# Altium schematic sheet Apollo_2.SchDoc
size A4
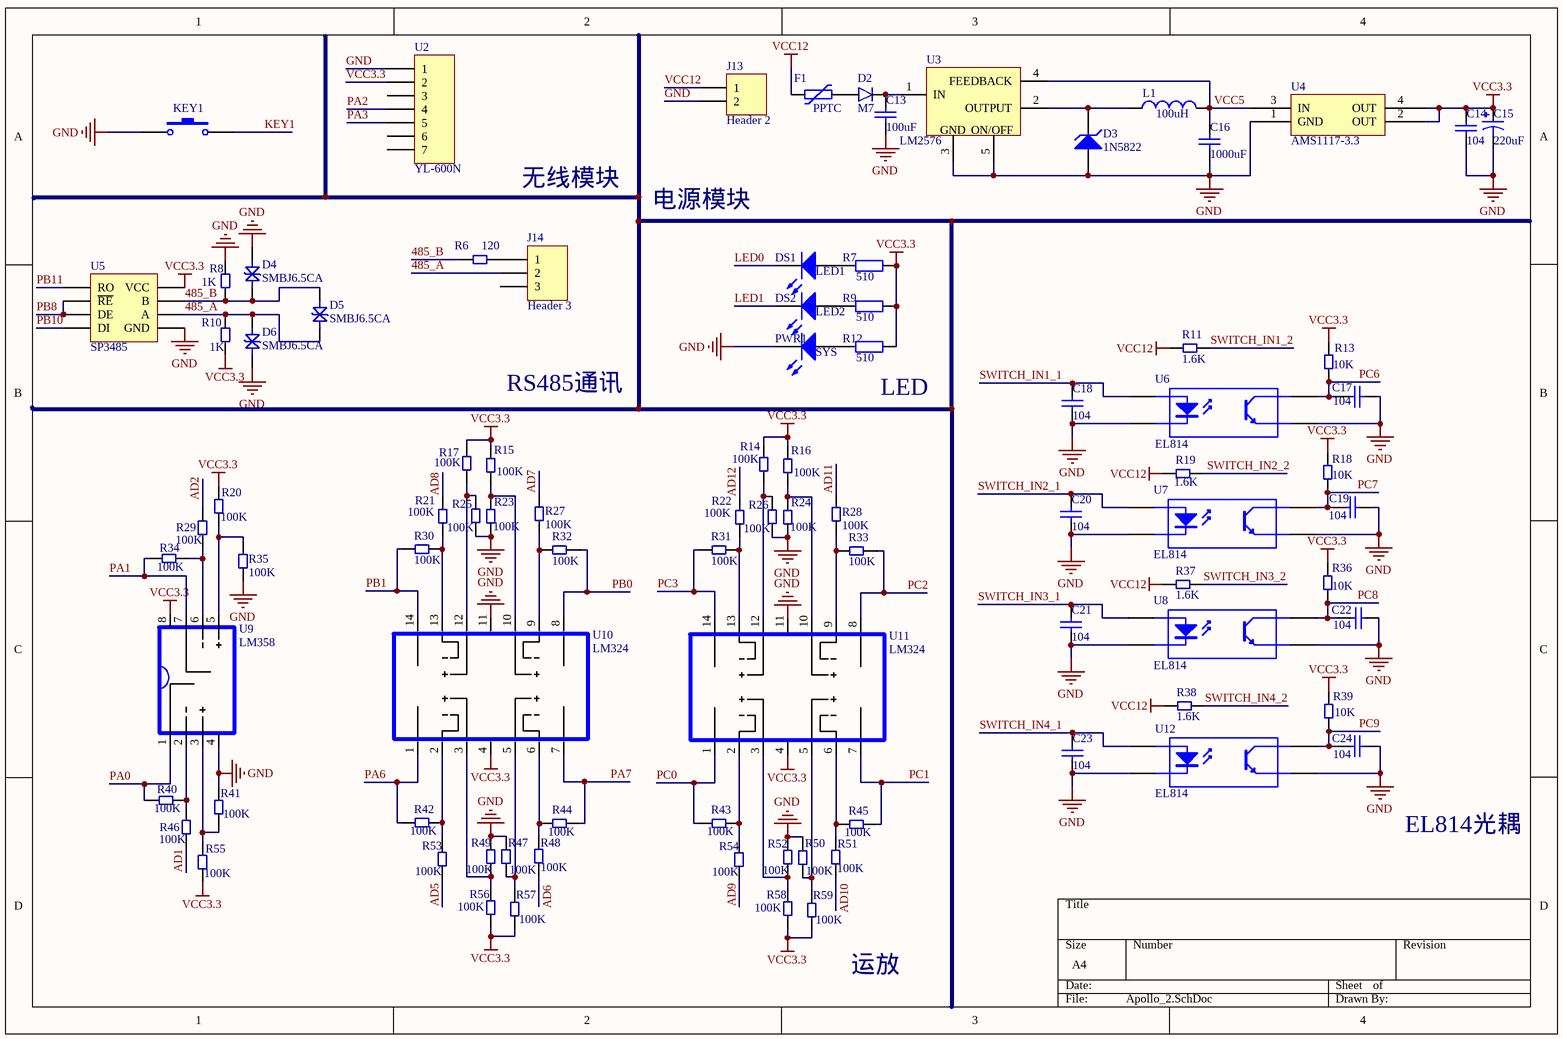
[diagram p0: Apollo_2.SchDoc]

## Parts
C13  value 100uF  [cap3.3-8 - duplicate]
C14  value 104  [0805]  (hidden comment: Cap)
C15  value 220uF  [C15]  (hidden comment: Cap Pol1)
C16  value 1000uF  [C16]
C17  value 104  [0805C]
C18  value 104  [0805C]
C19  value 104  [0805C]
C20  value 104  [0805C]
C21  value 104  [0805C]
C22  value 104  [0805C]
C23  value 104  [0805C]
C24  value 104  [0805C]
D2  M7  [SMA (DO-214AC)]
D3  1N5822  [smb do214aa]
D4  SMBJ6.5CA  [smb do214aa]
D5  SMBJ6.5CA  [smb do214aa]
D6  SMBJ6.5CA  [smb do214aa]
DS1  LED1  [0805-D]
DS2  LED2  [0805-D]
F1  PPTC  [1206]
J13  Header 2  [2EDG 2-3.80]
J14  Header 3  [HDR1X3]
KEY1  SW-PB  [SWITCH]  (value not drawn)
L1  value 100uH  [l1212]
PWR1  SYS  [0805-D]
R6  120  [0805]
R7  value 510  [0805]
R8  1K  [0805]
R9  value 510  [0805]
R10  1K  [0805]
R11  1.6K  [0805]
R12  value 510  [0805]
R13  10K  [0805]
R14  100K  [0805]
R15  100K  [0805]
R16  100K  [0805]
R17  100K  [0805]
R18  10K  [0805]
R19  1.6K  [0805]
R20  100K  [0805]
R21  100K  [0805]
R22  100K  [0805]
R23  100K  [0805]
R24  100K  [0805]
R25  100K  [0805]
R26  100K  [0805]
R27  100K  [0805]
R28  100K  [0805]
R29  100K  [0805]
R30  100K  [0805]
R31  100K  [0805]
R32  100K  [0805]
R33  100K  [0805]
R34  100K  [0805]
R35  100K  [0805]
R36  10K  [0805]
R37  1.6K  [0805]
R38  1.6K  [0805]
R39  10K  [0805]
R40  100K  [0805]
R41  100K  [0805]
R42  100K  [0805]
R43  100K  [0805]
R44  100K  [0805]
R45  100K  [0805]
R46  100K  [0805]
R47  100K  [0805]
R48  100K  [0805]
R49  100K  [0805]
R50  100K  [0805]
R51  100K  [0805]
R52  100K  [0805]
R53  100K  [0805]
R54  100K  [0805]
R55  100K  [0805]
R56  100K  [0805]
R57  100K  [0805]
R58  100K  [0805]
R59  100K  [0805]
U2  YL-600N  [HDR1X7]
U3  LM2576  [TO-263-5]
U4  AMS1117-3.3  [AMS1117-3.3]
U5  SP3485  [sop8]
U6  EL814  [SOP4]
U7  EL814  [SOP4]
U8  EL814  [SOP4]
U9  LM358  [sop8]
U10  LM324  [SOP-14]
U11  LM324  [SOP-14]
U12  EL814  [SOP4]

## Nets
GND: C13.1 C14.1 C15.2 C16.1 C17.1 C18.1 C19.1 C20.1 C21.1 C22.1 C23.1 C24.1 D3.1(A) D4.1 D6.2 J13.2 KEY1.1 PWR1.2(K) R8.2 R23.2 R24.2 R25.2 R26.2 R35.2 R41.2 R47.2 R49.2 R50.2 R52.2 U2.1 U3.3 U3.5 U4.1(GND) U5.5(GND) U6.2(K) U6.3(E) U7.2(K) U7.3(E) U8.2(K) U8.3(E) U9.4 U10.11 U11.11 U12.2(K) U12.3(E)
VCC3.3: C14.2 C15.1 R7.2 R9.2 R10.1 R12.2 R13.1 R14.1 R15.1 R16.1 R17.1 R18.1 R20.2 R36.1 R39.1 R55.1 R56.1 R57.1 R58.1 R59.1 U2.2 U4.2(OUT) U4.4(OUT) U5.8(VCC) U9.8 U10.4 U11.4
VCC12: F1.1 J13.1 R11.1 R19.1 R37.1 R38.1
485_A: D5.2 D6.1 J14.2 R10.2 U5.6(A)
485_B: D4.2 D5.1 R6.2 R8.1 U5.7(B)
AD1: R46.1
AD2: R29.2
AD5: R53.1
AD6: R48.1
AD7: R27.1
AD8: R21.1
AD9: R54.1
AD10: R51.1
AD11: R28.1
AD12: R22.1
KEY1: KEY1.2
LED0: DS1.2(K)
LED1: DS2.2(K)
PA0: R40.2 U9.1
PA1: R34.2 U9.7
PA2: U2.4
PA3: U2.5
PA6: R42.2 U10.1
PA7: R44.1 U10.7
PB0: R32.2 U10.8
PB1: R30.1 U10.14
PB8: U5.2(~{RE}) U5.3(DE)
PB10: U5.4(DI)
PB11: U5.1(RO)
PC0: R43.2 U11.1
PC1: R45.1 U11.7
PC2: R33.2 U11.8
PC3: R31.1 U11.14
PC6: C17.2 R13.2 U6.4(C)
PC7: C19.2 R18.2 U7.4(C)
PC8: C22.2 R36.2 U8.4(C)
PC9: C24.2 R39.2 U12.4(C)
SWITCH_IN1_1: C18.2 U6.1(A)
SWITCH_IN1_2: R11.2
SWITCH_IN2_1: C20.2 U7.1(A)
SWITCH_IN2_2: R19.2
SWITCH_IN3_1: C21.2 U8.1(A)
SWITCH_IN3_2: R37.2
SWITCH_IN4_1: C23.2 U12.1(A)
SWITCH_IN4_2: R38.2
VCC5: C16.2 L1.2 U3.4(FEEDBACK) U4.3(IN)
NetC13_2: C13.2 D2.1(-) U3.1(IN)
NetD2_2: D2.2(+) F1.2
NetD3_2: D3.2(K) L1.1 U3.2(OUTPUT)
NetDS1_1: DS1.1(A) R7.1
NetDS2_1: DS2.1(A) R9.1
NetJ14_1: J14.1 R6.1
NetPWR1_1: PWR1.1(A) R12.1
NetR14_2: R14.2 R26.1 U11.12
NetR15_2: R15.2 R23.1 U10.10
NetR16_2: R16.2 R24.1 U11.10
NetR17_2: R17.2 R25.1 U10.12
NetR20_1: R20.1 R35.1 U9.5
NetR21_2: R21.2 R30.2 U10.13
NetR22_2: R22.2 R31.2 U11.13
NetR27_2: R27.2 R32.1 U10.9
NetR28_2: R28.2 R33.1 U11.9
NetR29_1: R29.1 R34.1 U9.6
NetR40_1: R40.1 R46.2 U9.2
NetR41_1: R41.1 R55.2 U9.3
NetR42_1: R42.1 R53.2 U10.2
NetR43_1: R43.1 R54.2 U11.2
NetR44_2: R44.2 R48.2 U10.6
NetR45_2: R45.2 R51.2 U11.6
NetR47_1: R47.1 R57.2 U10.5
NetR49_1: R49.1 R56.2 U10.3
NetR50_1: R50.1 R59.2 U11.5
NetR52_1: R52.1 R58.2 U11.3

Not connected (* = marked no-connect by the designer): J14 3; U2 3 6 7

## Notes on the sheet
- (near U3) GND
- (near U3) ON/OFF
- Labels drawn without touching a wire or pin: EL814光耦, LED, RS485通讯, 无线模块, 电源模块, 运放

## Library data of the parts
C13 C14 C16-C24 = Cap: Capacitor; Published: 8-Jun-2000; LatestRevisionDate: 17-Jul-2002; LatestRevisionNote: Re-released for DXP Platform.; PackageReference: RAD-0.3; Publisher: Altium Limited; PackageDescription: Radial Cap, Thru-Hole; 2 Leads; 0.3 in Pin Spacing
C15 = Cap Pol1: Polarized Capacitor (Radial); Published: 8-Jun-2000; LatestRevisionDate: 17-Jul-2002; LatestRevisionNote: Re-released for DXP Platform.; PackageReference: RB7.6-15; Publisher: Altium Limited; PackageDescription: Polarized Capacitor (Radial); 2 Leads
D3 = D Zener: Zener Diode; Published: 8-Jun-2000; LatestRevisionDate: 17-Jul-2002; LatestRevisionNote: Re-released for DXP Platform.; PackageReference: DIODE-0.7; Publisher: Altium Limited; PackageDescription: Diode, Thru-Hole; 2 Leads; 0.7 in Pin Spacing
DS1 DS2 PWR1 = LED0: Typical INFRARED GaAs LED; Published: 8-Jun-2000; LatestRevisionDate: 08-Jul-2005; LatestRevisionNote: Mech Layer 1 removed.; PackageReference: LED-0; Publisher: Altium Limited; PackageDescription: LED; 2 Leads
J13 = Header 2: Header, 2-Pin; LatestRevisionDate: 17-Jul-2002; LatestRevisionNote: Re-released for DXP Platform.; Publisher: Altium Limited
J14 = Header 3: Header, 3-Pin; LatestRevisionDate: 17-Jul-2002; LatestRevisionNote: Re-released for DXP Platform.; Publisher: Altium Limited
KEY1 = SW-PB: Switch; Published: 24-Mar-1999; LatestRevisionDate: 17-Jul-2002; LatestRevisionNote: Re-released for DXP Platform.; PackageReference: SPST-2; Publisher: Altium Limited; PackageDescription: Switch; 2 Leads
L1 = Inductor: Code_IEC: 1005; Published: 8-Jun-2000; LatestRevisionDate: 29-May-2009; LatestRevisionNote: IPC-7351 Footprint Added.; PackageReference: 0402-A; Publisher: Altium Limited; PackageDescription: Chip Inductor; Code_JEITA: 0402
R6 R8 R10 R11 R13-R59 = Res
R7 R9 R12 = Res2: Resistor; Published: 8-Jun-2000; LatestRevisionDate: 17-Jul-2002; LatestRevisionNote: Re-released for DXP Platform.; PackageReference: AXIAL-0.4; Publisher: Altium Limited; PackageDescription: Axial Device, Thru-Hole; 2 Leads; 0.4 in Pin Spacing
U2 = Header 7: Header, 7-Pin; LatestRevisionDate: 17-Jul-2002; LatestRevisionNote: Re-released for DXP Platform.; Publisher: Altium Limited
U6-U8 U12 = TLP281
U10 U11 = LM324N